# EAGLE design Schematic (EAGLE 9.3.0)
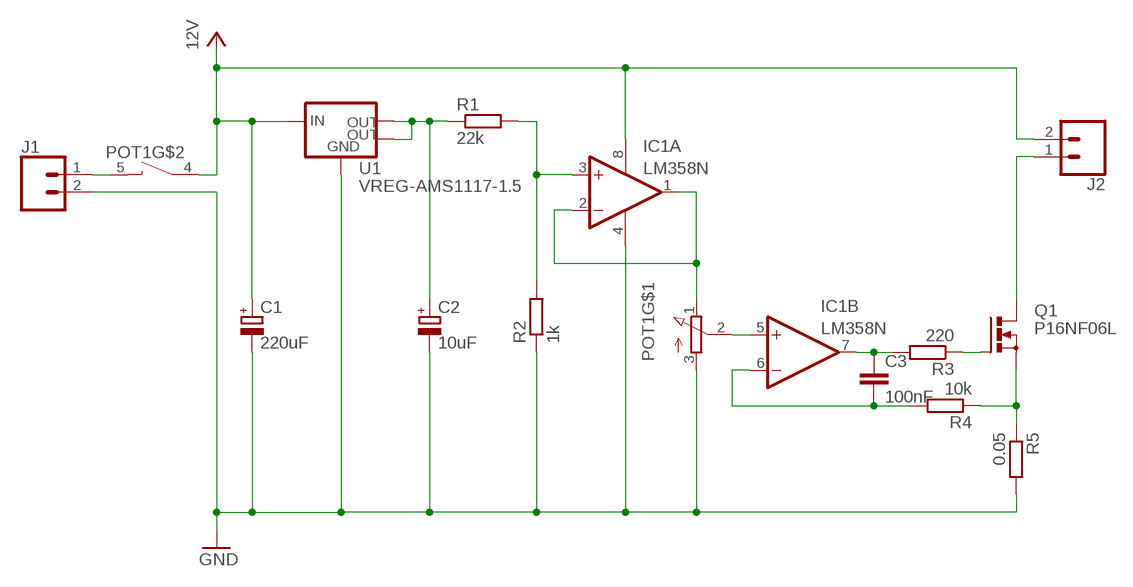
[diagram p0: schematic, sheet 1]

## Parts
C1  220uF  CPOL-EUF  [PANASONIC_F]
C2  10uF  CPOL-EUB  [PANASONIC_B]
C3  100nF  C-EU025-025X050  [C025-025X050]
IC1  LM358N  [DIL08]
J1  SCREW-TERM  [1X02_NO_SILK]
J2  SCREW-TERM  [1X02_NO_SILK]
POT1  POT-SWITCH  [POT-SWITCH-PTH]
Q1  P16NF06L  PMOSFET_NTO220BV  [TO220BV]
R1  22k  R-EU_R1206  [R1206]
R2  1k  R-EU_R1206  [R1206]
R3  220  R-EU_R1206  [R1206]
R4  10k  R-EU_R1206  [R1206]
R5  0.05  R-EU_R2512  [R2512]
U1  VREG-AMS1117-1.5  [SOT230P700X180-4]

## Nets
GND: C1.- C2.- IC1.4(P:V-) J1.2 POT1.3 R2.1 R5.2 U1.1(GND)
N$1: J1.1 POT1.5
N$2: IC1.3(A:+IN) R1.2 R2.2
N$3: C2.+ R1.1 U1.2(OUT) U1.4(OUT)
N$4: IC1.1(A:OUT) IC1.2(A:-IN) POT1.1
N$5: J2.1 Q1.D
N$6: C3.1 IC1.7(B:OUT) R3.2
N$7: Q1.G R3.1
N$8: C3.2 IC1.6(B:-IN) R4.2
N$9 [big]: Q1.S R4.1 R5.1
N$10: IC1.5(B:+IN) POT1.2
VCC: C1.+ IC1.8(P:V+) J2.2 POT1.4 U1.3(IN) ; supply symbol labelled 12V

## Library data of the parts
C1 C2 = rcl:CPOL-EU: POLARIZED CAPACITOR, European symbol; SPICEPREFIX: C
C3 = rcl:C-EU: CAPACITOR, European symbol; SPICEPREFIX: C
IC1 = linear:LM358: OP AMP also LM158; LM258; LM2904 Source: http://cache.national.com/ds/LM/LM158.pdf
J1 J2 = untitled:SCREW-TERM
POT1 = untitled:POT-SWITCH
Q1 = transistor-power:PMOSFET_N: Power MOSFET N-Channel
R1-R5 = rcl:R-EU_: RESISTOR, European symbol; SPICEPREFIX: R
U1 = untitled:VREG-AMS1117-1.5

## Net classes
0 default: width 0.356 mm, drill 0.356 mm, clearance 0.178 mm
1 big: width 1.067 mm, drill 1.067 mm, clearance 0.356 mm

## Board
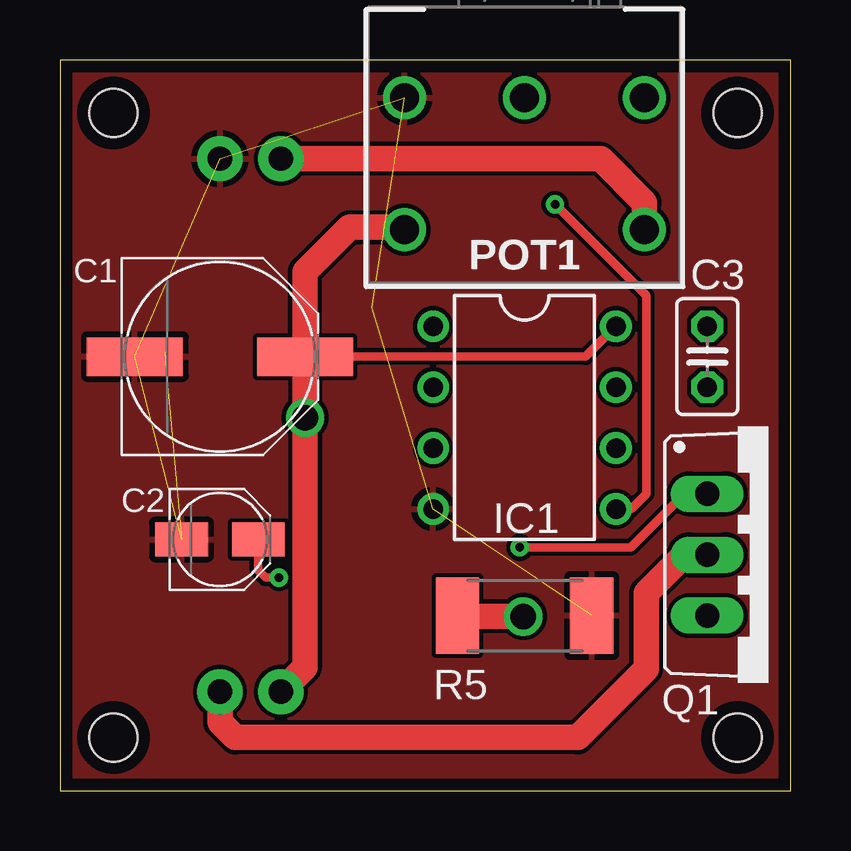
[diagram p1: board, top side]
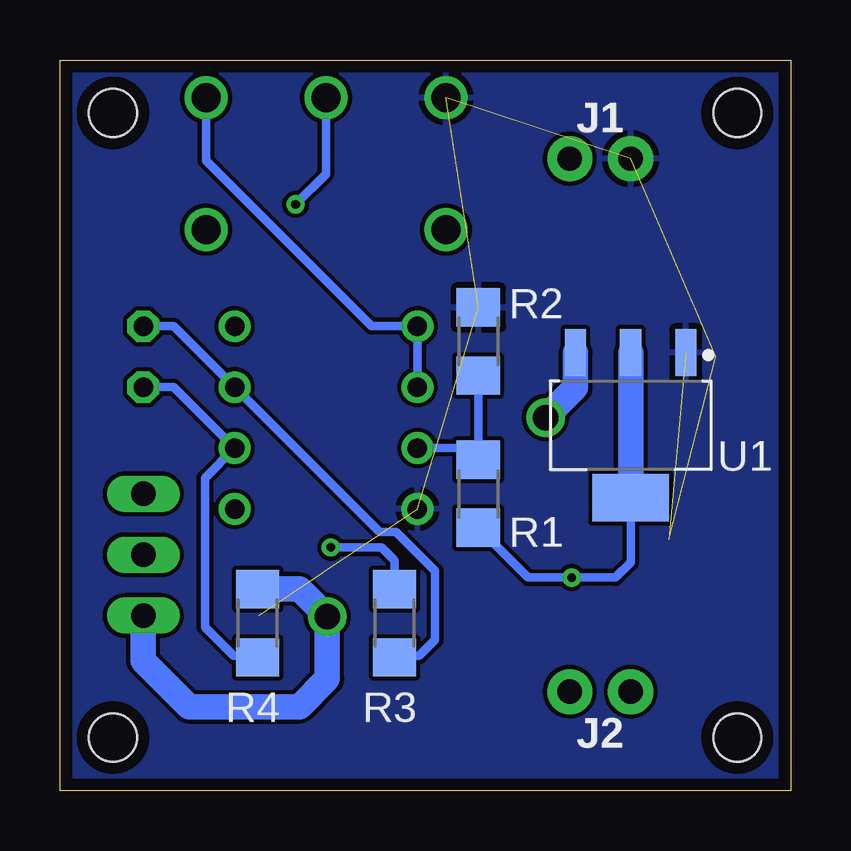
[diagram p2: board, bottom side, seen from below]

Size 30.46 x 30.47 mm. Coordinates in mm from the lower left corner, seen from the top.
Outline: 0,0 30.46,0 30.46,30.47 0,30.47 0,0
Copper layers (1*16): Top 0.035mm / dielectric 1.5mm / Bottom 0.035mm
Design rules "default *": minimum track width 6mil, minimum drill 0.35mm, track to track 6mil, track to pad 6mil, pad to pad 6mil, via to via 6mil, smd to smd 6mil, copper to edge 20mil, drill to drill 6mil, minimum pad ring 10mil, minimum via ring 8mil, stop-mask expansion 4mil, vias tented up to drill 0mil, thermal gap 10mil
Holes 2 mm at 28.26,28.26 2.22,2.22 2.22,28.26 28.26,2.22

### Footprints (pad centres in the part's own frame; a part is rotated, then mirrored left to right if it is on the bottom)
PANASONIC_F = smd 4 x 1.6: + 3.55,0; - -3.55,0
PANASONIC_B = smd 2.2 x 1.4: + 1.6,0; - -1.6,0
C025-025X050 = drill 0.813 octagon: 1 -1.27,0; 2 1.27,0
DIL08 = drill 0.813 pad 1.27: 1 -3.81,-3.81; 2 -1.27,-3.81; 3 1.27,-3.81; 4 3.81,-3.81; 5 3.81,3.81; 6 1.27,3.81; 7 -1.27,3.81; 8 -3.81,3.81
1X02_NO_SILK = drill 1.016 pad 1.88: 1 0,0; 2 2.54,0
POT-SWITCH-PTH = drill 1.2: 1 0,-5; 2 0,0; 3 0,5; 4 -5.5,5; 5 -5.5,-5
TO220BV = drill 1.016 long: D 0,-2.54; G -2.54,-2.54; S 2.54,-2.54
R1206 = smd 1.6 x 1.803: 1 -1.422,0; 2 1.422,0
R2512 = smd 1.8 x 3.2: 1 -2.8,0; 2 2.8,0
SOT230P700X180-4 = smd 1.965 x 0.889: 1 -3.023,2.3; 2 -3.023,0; 3 -3.023,-2.3 | smd 1.965 x 3.189: 4 3.023,0

### Placement (x,y rotation side)
C1  6.67,18.1 0 top
C2  6.67,10.48 0 top
C3  26.99,18.1 270 top
IC1  19.37,15.56 270 top
J1  9.21,26.35 0 bottom
J2  6.67,4.13 180 bottom
POT1  19.37,28.89 90 top
Q1  29.53,9.84 270 top
R1  13.02,12.38 90 bottom
R2  13.02,18.73 270 bottom
R3  16.51,6.98 270 bottom
R4  22.23,6.98 270 bottom
R5  19.37,7.3 0 top
U1  6.67,15.24 270 bottom

### Tracks (layer width: path | path; a pad name or v marks a point on that pad's centre or on a via)
GND  (7 unrouted)
  pour Top: 0,30.48 30.48,30.48 30.48,0 0,0
  pour Bottom: -0.32,30.8 30.8,30.8 30.8,-0.32 -0.32,-0.32
N$1
  Top 1.067: POT1.5 24.37,24.53 22.54,26.35 J1.1
N$2
  Bottom 0.356: 15.48,14.28 IC1.3 13.5,14.29 R1.2 R2.2
N$3  (via drill 0.36)
  Top 0.356: C2.+ 8.27,9.51 8.27,9.19 8.57,8.89 v9.13,8.89
  Bottom 0.356: 12.87,10.96 R1.1 10.95,8.89 v9.13,8.89 7.3,8.89 6.67,9.52 U1.4
  Bottom 1.067: U1.4 U1.2
N$4
  Bottom 0.356: IC1.1 IC1.2 | IC1.1 15.87,19.37 | IC1.1 17.46,19.37 24.37,26.27 POT1.1
N$5
  Top 1.067: J2.1 6.67,2.86 7.3,2.22 21.59,2.22 24.45,5.08 24.45,8.25 26.03,9.84 Q1.D
N$6
  Bottom 0.356: R3.2 16.41,5.61 15.48,5.61 14.81,6.28 14.81,9.16 16.45,10.8 17.15,10.8 IC1.7 25.72,19.37 C3.1
N$7  (via drill 0.36)
  Top 0.356: v19.17,10.15 23.8,10.15 26.03,12.38 Q1.G
  Bottom 0.356: R3.1 16.51,9.6 17.06,10.15 v19.17,10.15
N$8
  Bottom 0.356: R4.2 22.28,5.61 23.22,5.61 24.42,6.81 24.42,13.05 IC1.6 25.72,16.83 C3.2
N$9  (via drill 1.07)
  Top 1.067: v19.32,7.26 16.61,7.26 R5.1
  Bottom 1.067: R4.1 22.15,8.41 20.47,8.41 v19.32,7.26 19.32,4.66 20.48,3.5 25.08,3.5 27,5.42 27,7.29 Q1.S
N$10  (via drill 0.36)
  Top 0.356: IC1.5 23.81,11.75 24.45,12.38 24.45,20.64 v20.64,24.45
  Bottom 0.356: v20.64,24.45 19.37,25.72 POT1.2
VCC  (via drill 1.07)
  Top 0.356: IC1.8 21.91,18.1 C1.+
  Top 1.067: C1.+ v10.22,15.56 10.22,5.14 J2.2 | 10.16,18.16 C1.+ | C1.+ 10.22,21.65 12.06,23.49 14.26,23.49 POT1.4
  Bottom 1.067: U1.3 8.97,16.81 v10.22,15.56